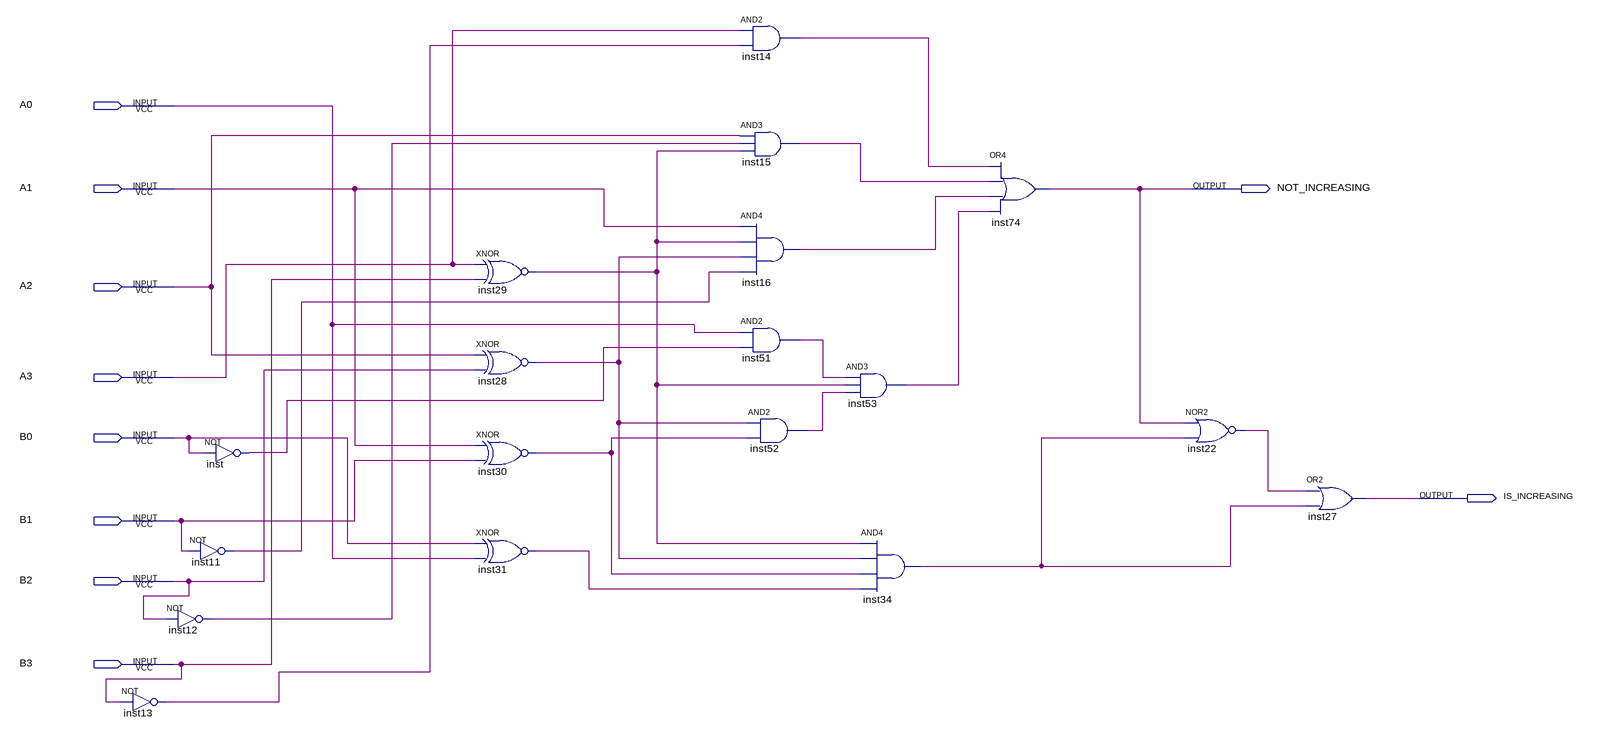
[diagram p0: schematic sheet]
// Quartus schematic Comparator.bdf as structural Verilog: 18 symbols, 10 pins
module Comparator (
  input  A0,
  input  A1,
  input  A2,
  input  A3,
  input  B0,
  input  B1,
  input  B2,
  input  B3,
  output NOT_INCREASING,
  output IS_INCREASING
);

  wire inst11_out, inst12_out, inst13_out, inst14_out, inst15_out, inst16_out, inst22_out, inst28_out,
       inst29_out, inst30_out, inst31_out, inst34_out, inst51_out, inst52_out, inst53_out, inst_out;

  not inst12 (inst12_out, B2);
  not inst13 (inst13_out, B3);
  not inst (inst_out, B0);
  not inst11 (inst11_out, B1);
  xnor inst29 (inst29_out, A3, B3);
  xnor inst28 (inst28_out, A2, B2);
  xnor inst30 (inst30_out, A1, B1);
  xnor inst31 (inst31_out, B0, A0);
  and inst14 (inst14_out, A3, inst13_out);
  and inst15 (inst15_out, A2, inst12_out, inst29_out);
  and inst16 (inst16_out, A1, inst29_out, inst28_out, inst11_out);
  and inst51 (inst51_out, A0, inst_out);
  and inst52 (inst52_out, inst28_out, inst30_out);
  and inst53 (inst53_out, inst51_out, inst29_out, inst52_out);
  and inst34 (inst34_out, inst29_out, inst28_out, inst30_out, inst31_out);
  or inst74 (NOT_INCREASING, inst14_out, inst15_out, inst16_out, inst53_out);
  nor inst22 (inst22_out, NOT_INCREASING, inst34_out);
  or inst27 (IS_INCREASING, inst22_out, inst34_out);
endmodule
